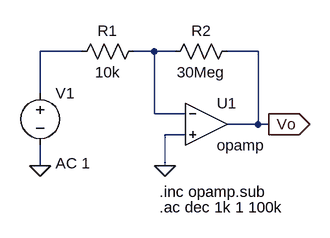
[diagram p0: schematic EJE1_A.asc]
EJE1_A.asc, the LTspice schematic file:
Version 4
SHEET 1 880 680
WIRE 32 112 -32 112
WIRE 144 112 112 112
WIRE 176 112 144 112
WIRE 304 112 256 112
WIRE -32 176 -32 112
WIRE 144 208 144 112
WIRE 192 208 144 208
WIRE 304 224 304 112
WIRE 304 224 256 224
WIRE 320 224 304 224
WIRE 192 240 160 240
WIRE -32 288 -32 256
WIRE 160 288 160 240
FLAG 160 288 0
FLAG -32 288 0
FLAG 320 224 Vo
IOPIN 320 224 Out
SYMBOL res 128 96 R90
WINDOW 0 0 56 VBottom 2
WINDOW 3 32 56 VTop 2
SYMATTR InstName R1
SYMATTR Value 10k
SYMBOL res 272 96 R90
WINDOW 0 0 56 VBottom 2
WINDOW 3 32 56 VTop 2
SYMATTR InstName R2
SYMATTR Value 30Meg
SYMBOL OpAmps\\opamp 224 160 R0
SYMATTR InstName U1
SYMATTR SpiceLine2 GBW=100Meg
SYMBOL voltage -32 160 R0
WINDOW 123 24 124 Left 2
WINDOW 39 0 0 Left 0
SYMATTR InstName V1
SYMATTR Value ""
SYMATTR Value2 AC 1
TEXT 152 328 Left 2 !.inc opamp.sub
TEXT 152 352 Left 2 !.ac dec 1k 1 100k

The netlist it stands for:
* EJE1_A.asc
R1 N002 N001 10k
R2 Vo N002 30Meg
XU1 N002 0 Vo opamp Aol=100K GBW=100Meg  ; pins invin noninvin out
V1 N001 0 AC 1
.inc opamp.sub
.ac dec 1k 1 100k
.backanno
.end